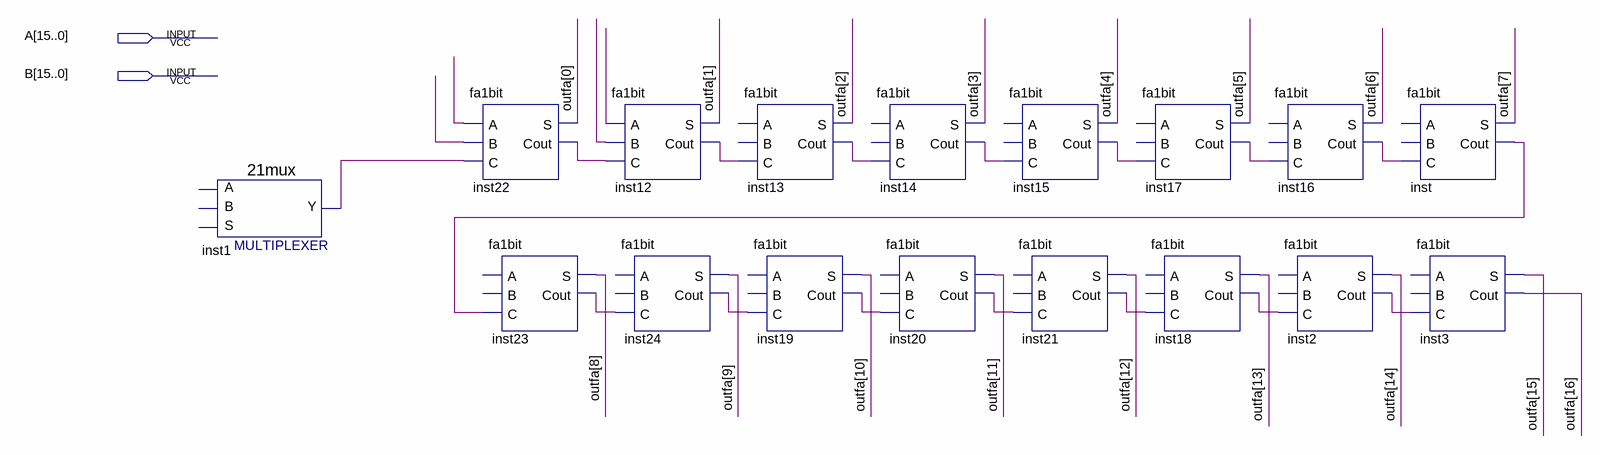
[diagram p0: schematic sheet]
// Quartus schematic fa16bit.bdf as structural Verilog: 17 symbols, 2 pins
module fa16bit (
  input  [15:0] A,
  input  [15:0] B
);

  wire inst1_y, inst2_cout, inst12_cout, inst13_cout, inst14_cout, inst15_cout, inst16_cout, inst17_cout,
       inst18_cout, inst19_cout, inst20_cout, inst21_cout, inst22_cout, inst23_cout, inst24_cout, inst_cout,
       undriven, undriven_2, undriven_3, undriven_4;
  wire [16:0] outfa;

  \21mux  inst1 (.Y(inst1_y));  // open: S, B, A
  fa1bit inst22 (.A(undriven), .B(undriven_2), .C(inst1_y), .S(outfa[0]), .Cout(inst22_cout));
  fa1bit inst23 (.C(inst_cout), .S(outfa[8]), .Cout(inst23_cout));  // open: A, B
  fa1bit inst12 (.A(undriven_4), .B(undriven_3), .C(inst22_cout), .S(outfa[1]), .Cout(inst12_cout));
  fa1bit inst24 (.C(inst23_cout), .S(outfa[9]), .Cout(inst24_cout));  // open: A, B
  fa1bit inst13 (.C(inst12_cout), .S(outfa[2]), .Cout(inst13_cout));  // open: A, B
  fa1bit inst19 (.C(inst24_cout), .S(outfa[10]), .Cout(inst19_cout));  // open: A, B
  fa1bit inst14 (.C(inst13_cout), .S(outfa[3]), .Cout(inst14_cout));  // open: A, B
  fa1bit inst20 (.C(inst19_cout), .S(outfa[11]), .Cout(inst20_cout));  // open: A, B
  fa1bit inst15 (.C(inst14_cout), .S(outfa[4]), .Cout(inst15_cout));  // open: A, B
  fa1bit inst21 (.C(inst20_cout), .S(outfa[12]), .Cout(inst21_cout));  // open: A, B
  fa1bit inst17 (.C(inst15_cout), .S(outfa[5]), .Cout(inst17_cout));  // open: A, B
  fa1bit inst18 (.C(inst21_cout), .S(outfa[13]), .Cout(inst18_cout));  // open: A, B
  fa1bit inst16 (.C(inst17_cout), .S(outfa[6]), .Cout(inst16_cout));  // open: A, B
  fa1bit inst2 (.C(inst18_cout), .S(outfa[14]), .Cout(inst2_cout));  // open: A, B
  fa1bit inst (.C(inst16_cout), .S(outfa[7]), .Cout(inst_cout));  // open: A, B
  fa1bit inst3 (.C(inst2_cout), .S(outfa[15]), .Cout(outfa[16]));  // open: A, B
endmodule
